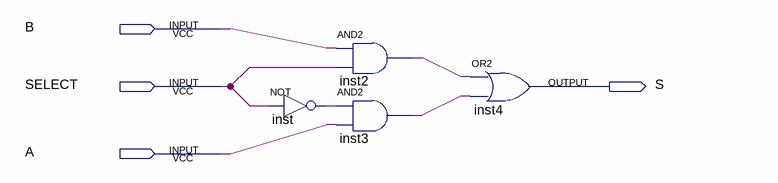
[diagram p0: schematic sheet]
// Quartus schematic mux_21.bdf as structural Verilog: 4 symbols, 4 pins
module mux_21 (
  input  B,
  input  SELECT,
  input  A,
  output S
);

  wire inst2_out, inst3_out, inst_out;

  not inst (inst_out, SELECT);
  and inst2 (inst2_out, B, SELECT);
  and inst3 (inst3_out, inst_out, A);
  or inst4 (S, inst2_out, inst3_out);
endmodule
